# EAGLE design untitled (EAGLE 7.7.0)
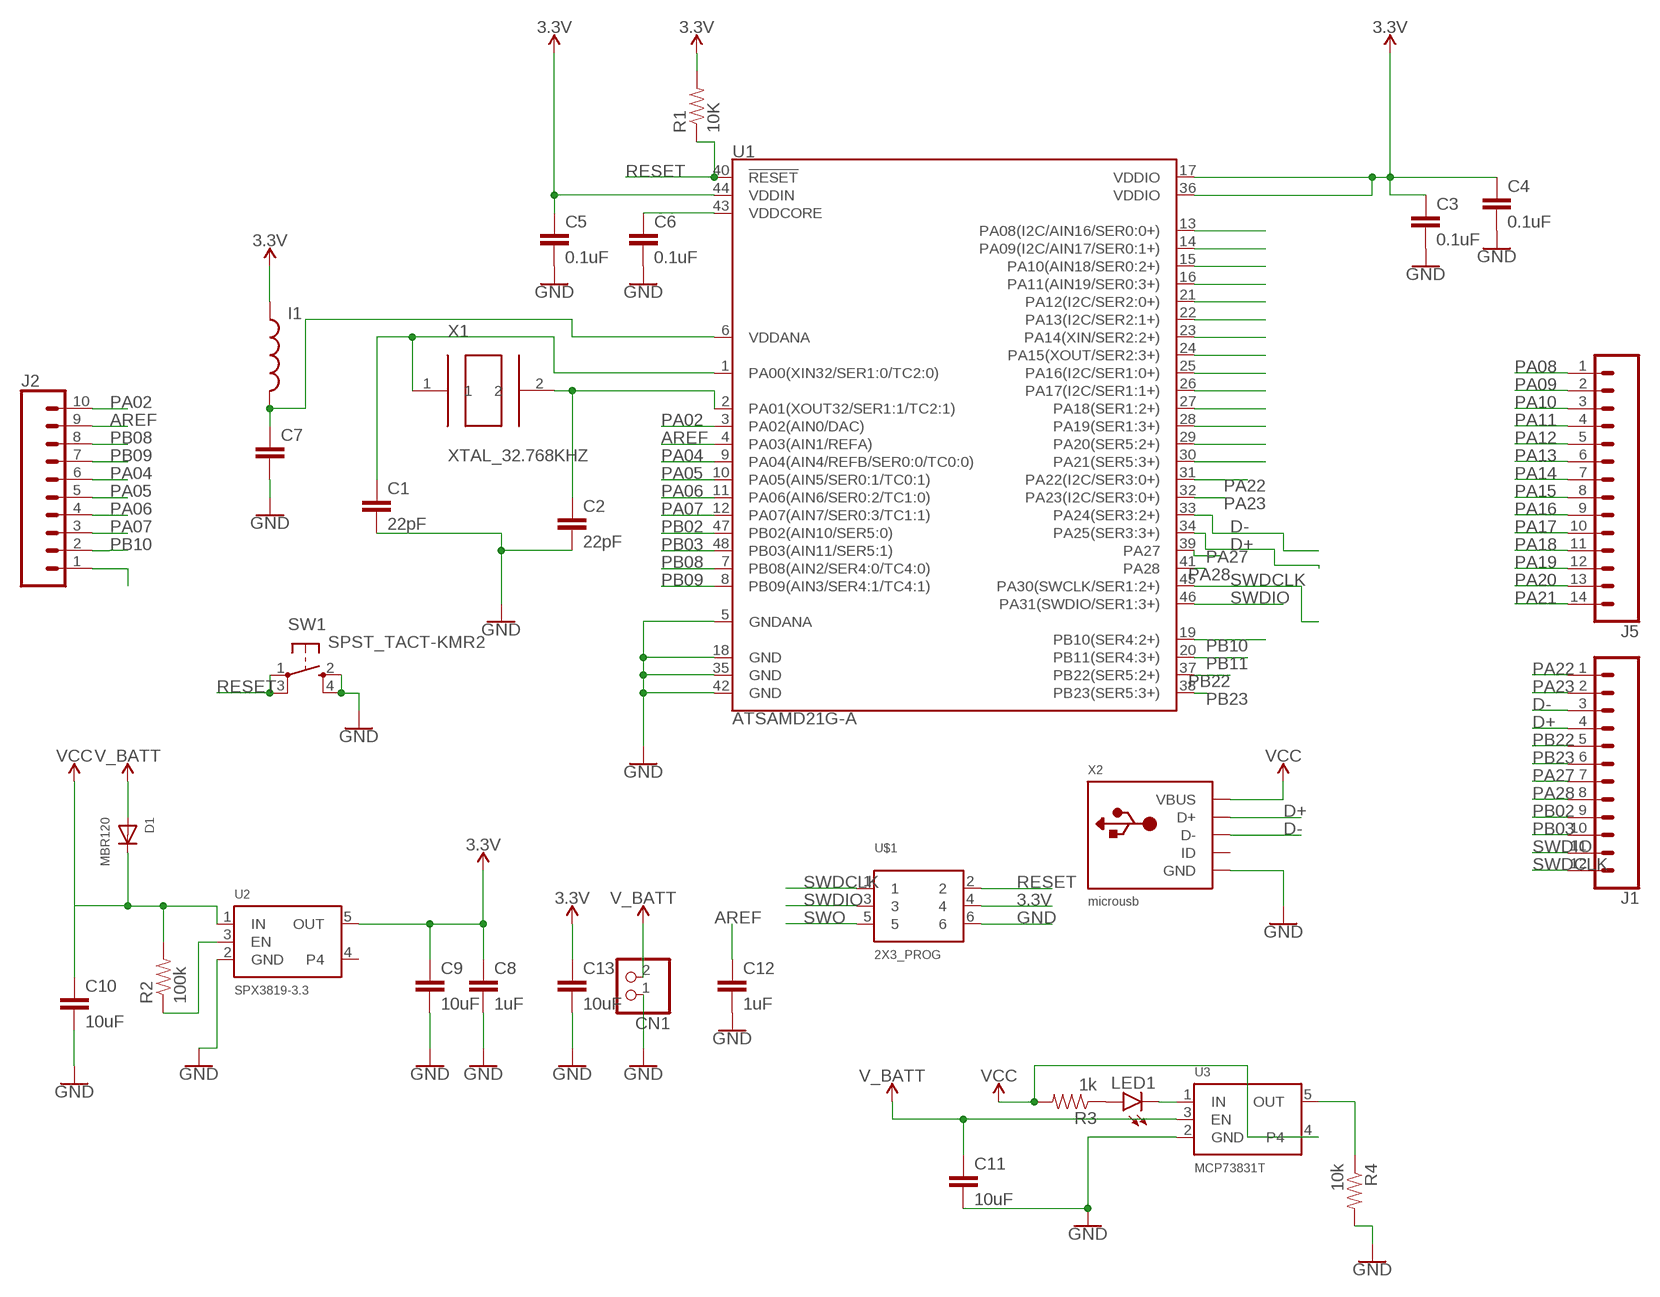
[diagram p0: schematic, sheet 1]

## Parts
C1  22pF  CAP  [0805]
C2  22pF  CAP  [0805]
C3  0.1uF  CAP  [0805]
C4  0.1uF  CAP  [0805]
C5  0.1uF  CAP  [0805]
C6  0.1uF  CAP  [0805]
C7  CAP  [0805]
C8  1uF  CAP  [0805]
C9  10uF  CAP  [0805]
C10  10uF  CAP  [0805]
C11  10uF  CAP  [0805]
C12  1uF  CAP  [0805]
C13  10uF  CAP  [0805]
CN1  JST_2PIN  [JSTPH2]
D1  MBR120  DIODESOD-123  [SOD-123]
I1  IND  [0805]
J1  CONN_12  [1X12]
J2  CONN_10"  [1X10]
J5  CONN_14  [1X14]
LED1  LED0603  [LED-0603]
R1  10K  RES  [0805]
R2  100k  RES  [0805]
R3  1k  RES  [0805]
R4  10k  RES  [0805]
SW1  SPST_TACT-KMR2  [KMR2]
U1  ATSAMD21G-A  [TQFP-48]
U2  SPX3819-3.3  VREG_SOT23-5  [SOT23-5]
U3  MCP73831T  VREG_SOT23-5  [SOT23-5]
U$1  2X3_PROG  [2X3-SMD_PROG]
X1  XTAL_32.768KHZ  [ABS07-32.768KHZ-9-T]
X2  microusb  USB_MICRO_20329_V2  [4UCONN_20329_V2]

## Nets
3.3V: C3.1 C4.1 C5.1 C8.1 C9.1 C13.1 I1.1 R1.2 U1.17(VDDIO) U1.36(VDDIO) U1.44(VDDIN) U2.5(OUT) U$1.4
AREF: C12.1 J2.9 U1.4(PA03(AIN1/REFA))
D+: J1.4 U1.34(PA25(SER3:3+)) X2.D+
D-: J1.3 U1.33(PA24(SER3:2+)) X2.D-
GND: C1.2 C2.2 C3.2 C4.2 C5.2 C6.2 C7.2 C8.2 C9.2 C10.2 C11.2 C12.2 C13.2 CN1.1 R4.2 SW1.2(S) SW1.4(S1) U1.5(GNDANA) U1.18(GND) U1.35(GND) U1.42(GND) U2.2(GND) U3.2(GND) U$1.6 X2.BASE@1(GND) X2.BASE@2(GND) X2.GND X2.SPRT@1(GND) X2.SPRT@2(GND) X2.SPRT@3(GND) X2.SPRT@4(GND)
N$2: C1.1 U1.1(PA00(XIN32/SER1:0/TC2:0)) X1.1
N$3: C2.1 U1.2(PA01(XOUT32/SER1:1/TC2:1)) X1.2
N$4: C6.1 U1.43(VDDCORE)
N$6: C7.1 I1.2 U1.6(VDDANA)
N$21: R2.1 U2.3(EN)
N$22: LED1.A R3.1
N$39: LED1.C U3.1(IN)
N$41: R4.1 U3.5(OUT)
PA02: J2.10 U1.3(PA02(AIN0/DAC))
PA04: J2.6 U1.9(PA04(AIN4/REFB/SER0:0/TC0:0))
PA05: J2.5 U1.10(PA05(AIN5/SER0:1/TC0:1))
PA06: J2.4 U1.11(PA06(AIN6/SER0:2/TC1:0))
PA07: J2.3 U1.12(PA07(AIN7/SER0:3/TC1:1))
PA08: J5.1 U1.13(PA08(I2C/AIN16/SER0:0+))
PA09: J5.2 U1.14(PA09(I2C/AIN17/SER0:1+))
PA10: J5.3 U1.15(PA10(AIN18/SER0:2+))
PA11: J5.4 U1.16(PA11(AIN19/SER0:3+))
PA12: J5.5 U1.21(PA12(I2C/SER2:0+))
PA13: J5.6 U1.22(PA13(I2C/SER2:1+))
PA14: J5.7 U1.23(PA14(XIN/SER2:2+))
PA15: J5.8 U1.24(PA15(XOUT/SER2:3+))
PA16: J5.9 U1.25(PA16(I2C/SER1:0+))
PA17: J5.10 U1.26(PA17(I2C/SER1:1+))
PA18: J5.11 U1.27(PA18(SER1:2+))
PA19: J5.12 U1.28(PA19(SER1:3+))
PA20: J5.13 U1.29(PA20(SER5:2+))
PA21: J5.14 U1.30(PA21(SER5:3+))
PA22: J1.1 U1.31(PA22(I2C/SER3:0+))
PA23: J1.2 U1.32(PA23(I2C/SER3:0+))
PA27: J1.7 U1.39(PA27)
PA28: J1.8 U1.41(PA28)
PB02: J1.9 U1.47(PB02(AIN10/SER5:0))
PB03: J1.10 U1.48(PB03(AIN11/SER5:1))
PB08: J2.8 U1.7(PB08(AIN2/SER4:0/TC4:0))
PB09: J2.7 U1.8(PB09(AIN3/SER4:1/TC4:1))
PB10: J2.2 U1.19(PB10(SER4:2+))
PB11: J2.1 U1.20(PB11(SER4:3+))
PB22: J1.5 U1.37(PB22(SER5:2+))
PB23: J1.6 U1.38(PB23(SER5:3+))
RESET: R1.1 SW1.1(P) SW1.3(P1) U1.40(!RESET!) U$1.2
SWDCLK: J1.12 U1.45(PA30(SWCLK/SER1:2+)) U$1.1
SWDIO: J1.11 U1.46(PA31(SWDIO/SER1:3+)) U$1.3
SWO: U$1.5
V_BATT: C11.1 CN1.2 D1.A U3.3(EN)
VCC: C10.1 D1.C R2.2 R3.2 U2.1(IN) U3.4 X2.VBUS
Unconnected: U2.4 X2.ID

## Library data of the parts
C1-C13 = Ilya_Teach:CAP
CN1 = microbuilder:JST_2PIN: JST 2-Pin Right-Angle Connector PH-Series - 4UConnector: 17311 SH-Series - 4UConnector: 07278
D1 = microbuilder:DIODE: Diode SMA Model Volts Amps Type Vf Vr Digikey # Notes SSA34-E3 40V 3A Schottky 480mV @ 3A 200uA @ 40V SSA34-E3/61TGITR-ND CDBA120-G 20V 1A Schottky 500mV @ 1A 500uA @ 20V 641-1014-6-ND REEL MBRA210 10V 2A Schottky 350mV @ 2A 700uA @ 10V MBRA210LT3 SOD-123 Model Volts Amps Type Vf Vr Order # Notes BAT54T1G 30V 200mA Schottky 800mV @ 200mA 2uA @ 25V BAT54T1GOSTR-ND B0530W 30V 500mA Schottky 430mV @ 500mA 130uA @ 30V B0530W-FDICT-ND REEL MBR120 1A 20V Schottky 340mV @ 1A MBR120VLSFT1GOSCT-ND SOD-323 Model Volts Amps Type Vf Vr Order # Notes PMEG2005EJ 20V 500mA Schottky 355mV @ 500mA 568-4110-1-ND ZLLS410 10V 570mA Schottky 380mV @ 570mA ZLLS410CT-ND 1N4148WS 75V 150mA Silicon/Simple 1V 1N4148WSFSCT-ND REEL SOD-523 Model Volts Amps Type Vf Vr Order # Notes BAT54XV2 30V 200mA Schottky 0.8V @ 100mA BAT54XV2CT-ND TB751S 30V 30mA Schottky RB751S-40TE61CT-ND SOT23-R/W (R = Solder Paste/Reflow Ovens, W = Hand-Soldering) Model Volts Amps Type Vf Vr Order # Notes BAT54FILM 40V 300mA Schottky 497-7162-1-ND
I1 = Ilya_Teach:IND
J1 = SparkFun-Connectors:CONN_12: Multi connection point. Often used as Generic Header-pin footprint for 0.1 inch spaced/style header connections On any of the 0.1 inch spaced packages, you can populate with these: Break Away Headers - Straight <https://www.sparkfun.com/products/116> (PRT-00116) Break Away Male Headers - Right Angle <https://www.sparkfun.com/products/553> (PRT-00553) Female Headers <https://www.sparkfun.com/products/115> (PRT-00115) Break Away Headers - Machine Pin <https://www.sparkfun.com/products/117> (PRT-00117) Break Away Female Headers - Swiss Machine Pin <https://www.sparkfun.com/products/743> (PRT-00743) For SCREWTERMINALS and SPRING TERMINALS visit here: Screw Terimnals on SparkFun.com <https://www.sparkfun.com/search/results?term=Screw+Terminals> (5mm/3.5mm/2.54mm spacing) This device is also useful as a general connection point to wire up your design to another part of your project. Our various solder wires solder well into these plated through hole pads. Hook-Up Wire - Assortment (Stranded, 22 AWG) <https://www.sparkfun.com/products/11375> (PRT-11375) Hook-Up Wire - Assortment (Solid Core, 22 AWG) <https://www.sparkfun.com/products/11367> (PRT-11367) View the entire wire category on our website here <https://www.sparkfun.com/categories/141> Special notes: Molex polarized connector foot print use with SKU : PRT-08231 with associated crimp pins and housings. 1MM SMD Version SKU: PRT-10208 NOTES ON THE VARIANTS LOCK and LOCK_LONGPADS... This footprint was designed to help hold the alignment of a through-hole component (i.e. 6-pin header) while soldering it into place. You may notice that each hole has been shifted either up or down by 0.005 of an inch from it's more standard position (which is a perfectly straight line). This slight alteration caused the pins (the squares in the middle) to touch the edges of the holes. Because they are alternating, it causes a "brace" to hold the component in place. 0.005 has proven to be the perfect amount of "off-center" position when using our standard breakaway headers. Although looks a little odd when you look at the bare footprint, once you have a header in there, the alteration is very hard to notice. Also,if you push a header all the way into place, it is covered up entirely on the bottom side.
J2 = SparkFun-Connectors:CONN_10: Multi connection point. Often used as Generic Header-pin footprint for 0.1 inch spaced/style header connections On any of the 0.1 inch spaced packages, you can populate with these: Break Away Headers - Straight <https://www.sparkfun.com/products/116> (PRT-00116) Break Away Male Headers - Right Angle <https://www.sparkfun.com/products/553> (PRT-00553) Female Headers <https://www.sparkfun.com/products/115> (PRT-00115) Break Away Headers - Machine Pin <https://www.sparkfun.com/products/117> (PRT-00117) Break Away Female Headers - Swiss Machine Pin <https://www.sparkfun.com/products/743> (PRT-00743) Arduino Stackable Header - 10 Pin <https://www.sparkfun.com/products/11376> (PRT-11376) For SCREWTERMINALS and SPRING TERMINALS visit here: Screw Terimnals on SparkFun.com <https://www.sparkfun.com/search/results?term=Screw+Terminals> (5mm/3.5mm/2.54mm spacing) This device is also useful as a general connection point to wire up your design to another part of your project. Our various solder wires solder well into these plated through hole pads. Hook-Up Wire - Assortment (Stranded, 22 AWG) <https://www.sparkfun.com/products/11375> (PRT-11375) Hook-Up Wire - Assortment (Solid Core, 22 AWG) <https://www.sparkfun.com/products/11367> (PRT-11367) View the entire wire category on our website here <https://www.sparkfun.com/categories/141> Special notes: Molex polarized connector foot print use with SKU : PRT-08231 with associated crimp pins and housings. 1MM SMD Version SKU: PRT-10208 NOTES ON THE VARIANTS LOCK and LOCK_LONGPADS... This footprint was designed to help hold the alignment of a through-hole component (i.e. 6-pin header) while soldering it into place. You may notice that each hole has been shifted either up or down by 0.005 of an inch from it's more standard position (which is a perfectly straight line). This slight alteration caused the pins (the squares in the middle) to touch the edges of the holes. Because they are alternating, it causes a "brace" to hold the component in place. 0.005 has proven to be the perfect amount of "off-center" position when using our standard breakaway headers. Although looks a little odd when you look at the bare footprint, once you have a header in there, the alteration is very hard to notice. Also,if you push a header all the way into place, it is covered up entirely on the bottom side.; PROD_ID: CONN-11563
J5 = SparkFun-Connectors:CONN_14: Multi connection point. Often used as Generic Header-pin footprint for 0.1 inch spaced/style header connections On any of the 0.1 inch spaced packages, you can populate with these: Break Away Headers - Straight <https://www.sparkfun.com/products/116> (PRT-00116) Break Away Male Headers - Right Angle <https://www.sparkfun.com/products/553> (PRT-00553) Female Headers <https://www.sparkfun.com/products/115> (PRT-00115) Break Away Headers - Machine Pin <https://www.sparkfun.com/products/117> (PRT-00117) Break Away Female Headers - Swiss Machine Pin <https://www.sparkfun.com/products/743> (PRT-00743) For SCREWTERMINALS and SPRING TERMINALS visit here: Screw Terimnals on SparkFun.com <https://www.sparkfun.com/search/results?term=Screw+Terminals> (5mm/3.5mm/2.54mm spacing) This device is also useful as a general connection point to wire up your design to another part of your project. Our various solder wires solder well into these plated through hole pads. Hook-Up Wire - Assortment (Stranded, 22 AWG) <https://www.sparkfun.com/products/11375> (PRT-11375) Hook-Up Wire - Assortment (Solid Core, 22 AWG) <https://www.sparkfun.com/products/11367> (PRT-11367) View the entire wire category on our website here <https://www.sparkfun.com/categories/141> Special notes: Molex polarized connector foot print use with SKU : PRT-08231 with associated crimp pins and housings. 1MM SMD Version SKU: PRT-10208 NOTES ON THE VARIANTS LOCK and LOCK_LONGPADS... This footprint was designed to help hold the alignment of a through-hole component (i.e. 6-pin header) while soldering it into place. You may notice that each hole has been shifted either up or down by 0.005 of an inch from it's more standard position (which is a perfectly straight line). This slight alteration caused the pins (the squares in the middle) to touch the edges of the holes. Because they are alternating, it causes a "brace" to hold the component in place. 0.005 has proven to be the perfect amount of "off-center" position when using our standard breakaway headers. Although looks a little odd when you look at the bare footprint, once you have a header in there, the alteration is very hard to notice. Also,if you push a header all the way into place, it is covered up entirely on the bottom side.
LED1 = Ilya_Teach:LED: LEDs Standard schematic elements and footprints for 5mm, 3mm, 1206, and 0603 sized LEDs. 5mm - Spark Fun Electronics SKU : COM-00529 (and others)
R1-R4 = Ilya_Teach:RES
SW1 = adafruit:SPST_TACT: SMT 6mm switch, EVQQ2 series http://www.ladyada.net/library/eagle
U1 = SparkFun-IC-Microcontroller:ATSAMD21G: Atmel SAMD21G SMART ARM-Based Microcontroller The Atmel ® | SMART ™ SAM D21 is a series of low-power microcontrollers using the 32-bit ARM ® Cortex ® -M0+ processor, and ranging from 32- to 64-pins with up to 256KB Flash and 32KB of SRAM. The SAM D21 devices operate at a maximum frequency of 48MHz and reach 2.46 CoreMark/MHz. They are designed for simple and intuitive migration with identical peripheral modules, hex compatible code, identical linear address map and pin compatible migration paths between all devices in the product series. All devices include intelligent and flexible peripherals, Atmel Event System for inter-peripheral signaling, and support for capacitive touch button, slider and wheel user interfaces. Datasheet <https://cdn.sparkfun.com/datasheets/Dev/Arduino/Boards/Atmel-42181-SAM-D21_Datasheet.pdf> SparkFun Products SparkFun SAMD21 Mini Breakout <https://www.sparkfun.com/products/13664> (DEV-13664) SparkFun SAMD21 Dev Breakout <https://www.sparkfun.com/products/13672> (DEV-13672); PROD_ID: IC-13064
U2 U3 = microbuilder:VREG_SOT23-5: SOT23-5 Fixed Voltage Regulators To better organise some of the SOT23-5 fixed voltage regulators in this library, this new part was created. Part Current Out V Out V In V Dropout Digikey Part No. ADP121 150mA 3.3V 3.4-5.5V 0.09V @ 150mA ADP121-AUJZ33R7CT-ND ADP121 150mA 3.0V 3.1-5.5V 0.09V @ 150mA ADP121-AUJZ30R7CT-ND ADP122 300mA 3.3V 3.4-5.5V 0.085V @ 300mA ADP122AUJZ-3.3-R7CT-ND ADP1712 300mA 3.3V 3.5-5.5V 0.17V @ 300mA ADP1712AUJZ-3.3-R7TR-ND AP7311 (Low Cost) 150mA 3.3V 3.5-6V 0.15V @ 150mA AP7311-33WG-7DICT-ND LD39015M18R 150mA 1.8V 1.9V-5.5V 0.08V @ 100mA 497-6977-1-ND MCP1824T-3302E/OT 300mA 3.3V 3.5V-6V 0.2V @ 300mA MCP1824T-3302E/OTCT-ND MIC5205-2.5YM5 TR 150mA 2.5V 2.7-16V 0.165V @ 150mA 576-1257-2-ND MIC5205-3.0YM5 TR 150mA 3.0V 3.2V-16V 0.165V @ 150mA 576-1258-2-ND MIC5205-3.3YM5 TR 150mA 3.3V 3.5V-16V 0.165V @ 150mA 576-1259-2-ND TPS780330220 150mA 3.3V+2.2V 3.6-5.5V 250mV Max 296-23332-1-ND TDA3663/N1,135 100mA 3.3V 3.5-45V 0.18V @ 50mA 568-5343-1-ND
U$1 = Ilya_Teach:2X3_PROG
X1 = Ilya_Teach:XTAL_32.768KHZ
X2 = microbuilder:USB: USB Connectors USBMINIB - Surface Mount Female Mini-B USB Connector 4UConnector: 06564

## Board
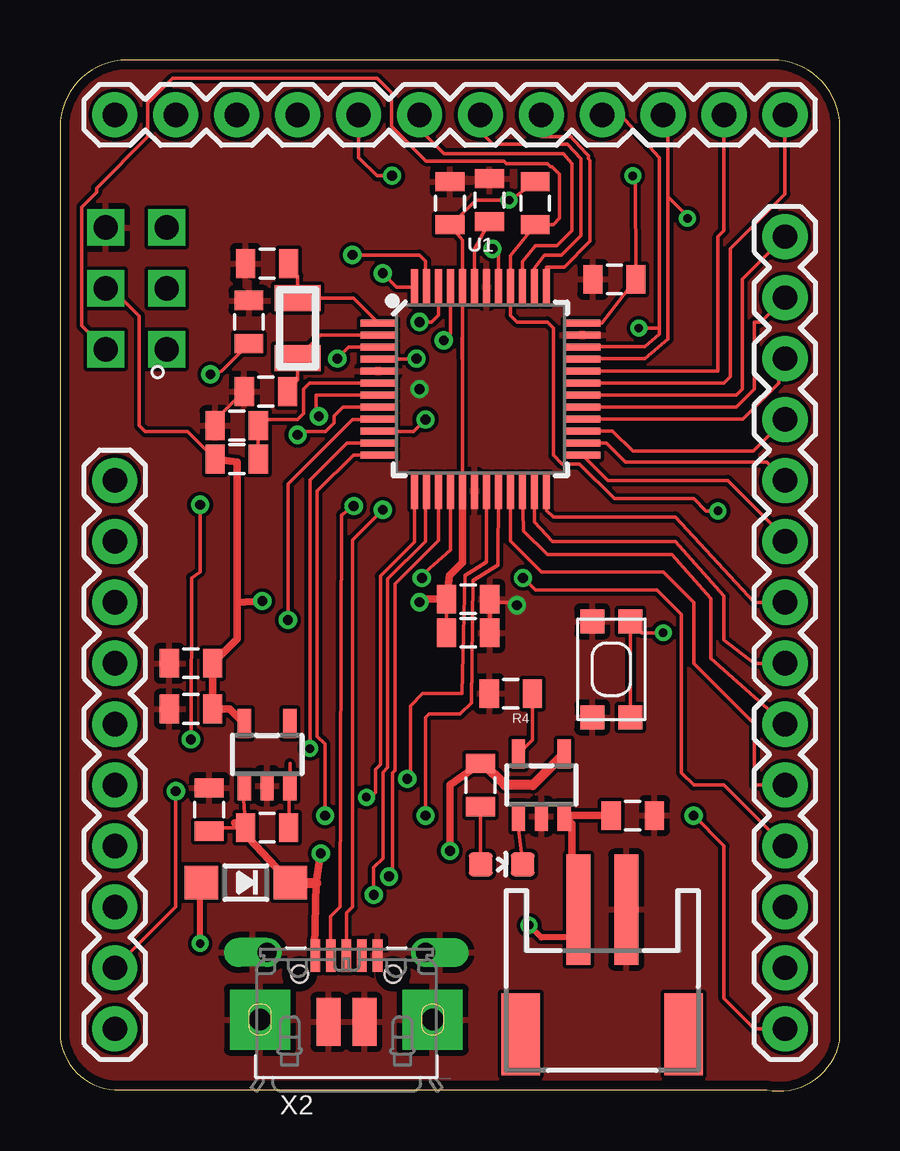
[diagram p1: board, top side]
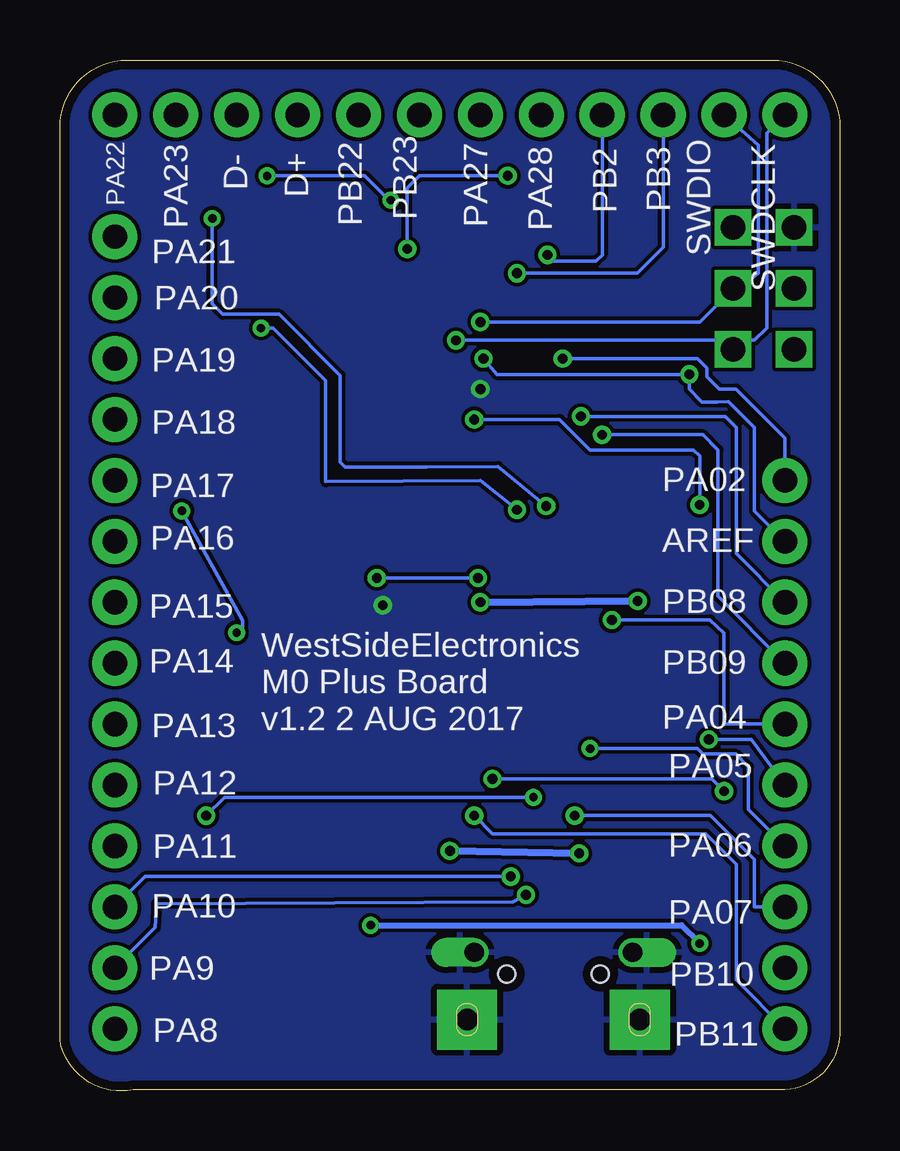
[diagram p2: board, bottom side, seen from below]

Size 32.51 x 42.98 mm. Coordinates in mm from the lower left corner, seen from the top.
Outline: 29.72,42.98 2.8,42.98 arc90 0,40.18 0,2.59 arc90 2.29,0.05 29.47,0.05 arc90 32.51,2.08 32.51,40.18 arc90 29.72,42.98
Copper layers (1*16): Top 0.0356mm / dielectric 1.5011mm / Bottom 0.0356mm
Design rules "LaenPCBOrder": minimum track width 6mil, minimum drill 13mil, track to track 6mil, track to pad 6mil, pad to pad 6mil, via to via 6mil, smd to smd 6mil, copper to edge 15mil, drill to drill 6mil, minimum pad ring 7mil, minimum via ring 7mil, stop-mask expansion 3mil, vias tented up to drill 0mil, thermal gap 10mil

### Footprints (pad centres in the part's own frame; a part is rotated, then mirrored left to right if it is on the bottom)
0805 = smd 0.8 x 1.2: 1 -0.9,0; 2 0.9,0
JSTPH2 = smd 1 x 4.6: 1 -1,-3.7; 2 1,-3.7 | smd 1.6 x 3.4: NC1 -3.4,1.5; NC2 3.4,1.5
SOD-123 = smd 1.4 x 1.4: A 1.85,0; C -1.85,0
1X12 = drill 1.016 pad 1.88: 1 0,0; 2 2.54,0; 3 5.08,0; 4 7.62,0; 5 10.16,0; 6 12.7,0; 7 15.24,0; 8 17.78,0; 9 20.32,0; 10 22.86,0; 11 25.4,0; 12 27.94,0
1X10 = drill 1.016 pad 1.88: 1 0,0; 2 2.54,0; 3 5.08,0; 4 7.62,0; 5 10.16,0; 6 12.7,0; 7 15.24,0; 8 17.78,0; 9 20.32,0; 10 22.86,0
1X14 = drill 1.016 pad 1.88: 1 0,0; 2 2.54,0; 3 5.08,0; 4 7.62,0; 5 10.16,0; 6 12.7,0; 7 15.24,0; 8 17.78,0; 9 20.32,0; 10 22.86,0; 11 25.4,0; 12 27.94,0; 13 30.48,0; 14 33.02,0
LED-0603 = smd 1 x 1: A 0,-0.877; C 0,0.877
KMR2 = smd 1 x 1: 1 2,0.8; 2 2,-0.8; 3 -2,0.8; 4 -2,-0.8
TQFP-48 = smd 1.5 x 0.28: 1 -4.25,2.75; 2 -4.25,2.25; 3 -4.25,1.75; 4 -4.25,1.25; 5 -4.25,0.75; 6 -4.25,0.25; 7 -4.25,-0.25; 8 -4.25,-0.75; 9 -4.25,-1.25; 10 -4.25,-1.75; 11 -4.25,-2.25; 12 -4.25,-2.75; 25 4.25,-2.75; 26 4.25,-2.25; 27 4.25,-1.75; 28 4.25,-1.25; 29 4.25,-0.75; 30 4.25,-0.25; 31 4.25,0.25; 32 4.25,0.75; 33 4.25,1.25; 34 4.25,1.75; 35 4.25,2.25; 36 4.25,2.75 | smd 0.28 x 1.5: 13 -2.75,-4.25; 14 -2.25,-4.25; 15 -1.75,-4.25; 16 -1.25,-4.25; 17 -0.75,-4.25; 18 -0.25,-4.25; 19 0.25,-4.25; 20 0.75,-4.25; 21 1.25,-4.25; 22 1.75,-4.25; 23 2.25,-4.25; 24 2.75,-4.25; 37 2.75,4.25; 38 2.25,4.25; 39 1.75,4.25; 40 1.25,4.25; 41 0.75,4.25; 42 0.25,4.25; 43 -0.25,4.25; 44 -0.75,4.25; 45 -1.25,4.25; 46 -1.75,4.25; 47 -2.25,4.25; 48 -2.75,4.25
SOT23-5 = smd 0.55 x 1.2: 1 -0.95,-1.3; 2 0,-1.3; 3 0.95,-1.3; 4 0.95,1.3; 5 -0.95,1.3
2X3-SMD_PROG = drill 1.016 pad 1.27 square: 1 -1.27,-1.27; 2 -1.27,1.27; 3 1.27,-1.27; 4 1.27,1.27; 5 3.81,-1.27; 6 3.81,1.27
ABS07-32.768KHZ-9-T = smd 1.1 x 1.9: 1 -1.25,0; 2 1.25,0
4UCONN_20329_V2 = smd 1 x 2: BASE@1 -0.75,-2; BASE@2 0.75,-2 | smd 0.4 x 1.35: D+ 0,0.775; D- -0.65,0.775; GND 1.3,0.775; ID 0.65,0.775; VBUS -1.3,0.775 | drill 0.8 pad 1.2 offset: SPRT@1 -3.3,0.9; SPRT@2 3.3,0.9 | drill 0.9 pad 2.5 square: SPRT@3 -3.6,-1.9; SPRT@4 3.6,-1.9 | hole 0.7: -1.95,0; 1.95,0

### Placement (x,y rotation side)
C1  8.64,34.49 180 top
C2  8.59,29.16 180 top
C3  17.02,20.5 0 top
C4  23.12,33.83 180 top
C5  16.26,37.01 90 top
C6  17.91,37.13 90 top
C7  7.37,27.74 180 top
C8  5.46,17.83 180 top
C9  5.46,15.93 180 top
C10  6.22,11.73 90 top
C11  23.88,11.48 0 top
C12  7.88,32.05 90 top
C13  17.02,19.1 0 top
CN1  22.61,3.86 180 top
D1  7.75,8.69 180 top
I1  7.37,26.34 0 top
J1  30.23,40.69 180 top
J2  2.29,2.59 90 top
J5  30.23,2.59 90 top
LED1  18.42,9.45 270 top
R1  19.81,37.01 90 top
R2  8.64,10.97 180 top
R3  17.53,12.75 90 top
R4  18.8,16.56 180 top
SW1  22.99,17.58 270 top
U1  17.53,29.26 0 top
U2  8.64,14.02 0 top
U3  20.07,12.75 0 top
U$1  3.18,32.18 90 top
X1  9.91,31.8 270 top
X2  11.94,4.88 0 top

### Tracks (layer width: path | path; a pad name or v marks a point on that pad's centre or on a via)
3.3V  (via drill 0.35, 0.41)
  Top 0.152: 16.28,36.08 16.78,35.46 U1.44 16.78,32.32 | 16.28,36.08 C5.1 | U1.36 22.6,32.01 C4.1 23.99,38.03 v23.88,38.15 | U1.17 16.78,32.32 | 16.77,30.53 16.78,32.32 | C13.1 C3.1 | U$1.4 2.16,33.45 3.3,32.31 3.3,27.74 3.56,27.48 5.32,27.48 I1.1 | R1.2 18.79,37.13 v18.72,37.13 17.33,37.13 16.28,36.08
  Top 0.305: I1.1 7.38,26.21 7.38,20.37 | 7.38,20.37 7.38,18.85 C8.1 C9.1 7.08,15.93 U2.5 | 7.38,20.37 v8.43,20.42 | 16.26,20.37 C3.1 | U1.17 16.78,22.02 16.25,21.49 C3.1 | v14.99,20.37 15.11,20.5 C3.1
  Bottom 0.152: v8.43,20.42 8.89,20.37 | v23.88,38.15 19.81,38.15 18.8,37.13 v18.72,37.13
  Bottom 0.305: v8.43,20.42 v14.99,20.37
AREF  (via drill 0.41)
  Top 0.152: U1.4 14.97,30.51 v14.86,30.53 | C12.1 6.73,30.01 v6.28,29.87
  Bottom 0.152: v14.86,30.53 14.3,29.87 v6.28,29.87 6.28,29.26 5.75,28.73 5.11,28.73 4.66,28.73 3.56,27.65 3.56,24.18 J2.9
D+  (via drill 0.35, 0.41)
  Top 0.152: v13.46,24.23 12.19,22.96 12.19,7.67 11.94,7.42 X2.D+ | U1.34 21.81,31.04 24.39,31.04 25,31.55 25,31.82 | 25,31.82 25,38.91 23.37,40.69 J1.4 | v24.13,31.8 24.98,31.8 25,31.82
  Bottom 0.152: v13.46,24.23 14.99,25.45 21.44,25.4 21.44,29.62 23.62,31.8 v24.13,31.8
D-  (via drill 0.35, 0.41)
  Top 0.152: v12.24,24.38 11.8,24.05 11.74,24 11.69,7.67 11.29,7.27 X2.D- | U1.33 21.8,30.53 24.39,30.53 25.35,31.34 25.35,37.27 | J1.3 25.35,40.39 25.35,37.27 | v26.16,36.37 26.16,36.46 25.35,37.27
  Bottom 0.152: v12.24,24.38 14.25,26.03 17.22,26.01 18.8,26.01 | 18.8,26.01 18.98,26.01 | 18.8,26.01 20.63,26.01 20.83,26.21 20.83,29.83 23.38,32.38 25.73,32.38 26.16,32.82 v26.16,36.37
GND  (via drill 0.41)
  Top 0.152: C2.2 6.47,27.99 C7.2 | C13.2 C3.2 17.92,20.37 18.8,20.37
  other vias: 19.05,20.24 14.99,29.26
  pour Top: -0.25,48.31 48.01,48.31 48.01,0.05 -0.25,0.05 -0.25,47.04
  pour Bottom: -0.25,48.31 48.01,48.31 48.01,0.05 -0.25,0.05
N$2
  Top 0.152: C1.1 9.91,33.97 X1.1 12.24,33.05 U1.1
N$3
  Top 0.152: C2.1 9.91,29.63 X1.2 10.87,31.51 U1.2
N$4
  Top 0.152: U1.43 17.28,35.1 C6.1
N$6
  Top 0.152: I1.2 C7.1 8.26,27.98 9.91,27.99 10.16,28.24 10.16,29.26 10.41,29.51 U1.6
N$21
  Top 0.152: R2.1 9.59,13.65 U2.3
N$22
  Top 0.152: LED1.A R3.1
N$39
  Top 0.152: LED1.C 19.12,10.92 U3.1
N$41
  Top 0.152: U3.5 19.7,14.63 R4.1
PA02  (via drill 0.41)
  Top 0.152: U1.3 12.04,31.01 v11.56,30.53
  Bottom 0.152: v11.56,30.53 5.94,30.53 5.54,30.13 5.54,29.78 5.02,29.26 4.34,29.26 2.29,27.21 J2.10
PA04  (via drill 0.41)
  Top 0.152: U1.9 13.26,27.99 12.19,27.99 11.05,26.85 10.92,26.72 9.5,25.3 v9.5,19.63
  Bottom 0.152: v9.5,19.63 5.41,19.63 4.83,19.1 4.83,15.29 J2.6
PA05  (via drill 0.41)
  Top 0.152: v5.84,24.43 5.84,21.64 5.49,21.39 v5.46,14.66 | v15.24,27.99 14.73,27.48 13.72,27.48 13.69,27.51 U1.10
  Bottom 0.152: v5.46,14.66 3.68,14.66 J2.5 | v15.24,27.99 11.69,27.99 10.42,26.72 6.1,26.72 5.84,26.47 v5.84,24.43
PA06  (via drill 0.35)
  Top 0.152: U1.11 11.98,27.01 10.42,25.46 10.42,14.28 v10.42,14.27
  Bottom 0.152: J2.4 3.81,11.73 3.81,13.51 4.34,14.05 5.72,14.05 5.94,14.27 v10.42,14.27
PA07  (via drill 0.41)
  Top 0.152: 13.72,26.51 U1.12 12.24,26.51 10.73,25 10.73,14.78 11.05,14.46 v11.05,11.48
  Bottom 0.152: v11.05,11.48 5.39,11.48 3.56,9.65 3.56,7.67 J2.3
PA08  (via drill 0.35, 0.41)
  Top 0.152: J5.1 28.96,2.59 27.69,3.86 27.69,10.21 v26.42,11.48 | U1.13 14.78,22.88 13.36,21.46 13.36,13.61 13.16,13.41 13.16,12.45 12.96,12.24 v12.77,12.24
  Bottom 0.152: v12.77,12.24 25.66,12.24 v26.42,11.48
PA09  (via drill 0.41)
  Top 0.152: v13.08,8.18 13.08,9.32 13.46,9.7 13.46,13.28 13.67,13.48 13.67,21.34 15.24,22.91 15.24,24.97 U1.14
  Bottom 0.152: v13.08,8.18 13.63,7.88 28.49,7.81 28.54,6.82 J5.2
PA10  (via drill 0.41)
  Top 0.152: U1.15 15.78,22.94 13.97,21.13 13.97,13.36 13.87,13.26 13.87,9.09 v13.72,8.94
  Bottom 0.152: v13.72,8.94 28.96,8.94 J5.3
PA11  (via drill 0.41)
  Top 0.152: 16.26,24.99 arc-90 U1.16 16.28,22.55 15.24,21.64 v15.09,21.39 | J5.4 27.69,12.75 26.42,12.75 25.91,13.26 25.91,19.86 24.89,20.88 19.81,20.88 v19.31,21.39
  Bottom 0.152: v15.09,21.39 v19.31,21.39
PA12
  Top 0.152: U1.21 18.78,22.93 20.07,21.64 25.15,21.64 26.42,20.37 26.42,17.83 28.96,15.29 28.96,12.75 J5.5
PA13
  Top 0.152: J5.6 27.13,18.03 27.13,20.52 25.5,22.35 20.32,22.35 19.33,23.34 U1.22
PA14
  Top 0.152: J5.7 28.96,17.83 27.69,18.8 27.69,20.62 25.66,22.91 20.52,22.91 19.78,23.71 U1.23
PA15
  Top 0.152: U1.24 20.29,24.2 20.57,23.93 25.66,23.93 28.96,20.37 J5.8
PA16
  Top 0.152: U1.25 22.84,25.45 27.84,25.45 30.23,23.06 J5.9
PA17
  Top 0.152: U1.26 22.77,27.01 23.57,26.21 29.47,26.21 J5.10
PA18
  Top 0.152: U1.27 23.04,27.51 23.88,26.67 28.91,26.67 J5.11
PA19
  Top 0.152: U1.28 28.47,28.01 29.97,29.51 29.97,30.28 J5.12
PA20
  Top 0.152: U1.29 28.21,28.51 28.96,29.26 28.96,32.05 29.21,32.05 J5.13
PA21
  Top 0.152: U1.30 28.2,29.01 28.45,29.26 28.45,33.83 J5.14
PA22
  Top 0.152: U1.31 27.68,29.51 27.94,29.77 27.94,35.1 30.23,37.39 J1.1
PA23
  Top 0.152: U1.32 27.42,30.01 27.43,30.02 27.43,35.61 27.69,35.86 J1.2
PA27
  Top 0.152: U1.39 19.28,34.57 19.81,35.23 20.71,35.23 21.35,35.86 21.34,38.66 20.98,39.06 16,39.06 14.99,40.08 J1.7
PA28  (via drill 0.41)
  Top 0.152: U1.41 18.28,34.85 v18.04,35.1 | v13.84,38.15 13.21,38.15 12.45,38.91 J1.8
  Bottom 0.152: v18.04,35.1 18.04,37.64 17.53,38.15 v13.84,38.15
PB02  (via drill 0.41)
  Top 0.152: v12.19,34.85 14.99,34.85 15.24,34.59 15.24,33.55 U1.47
  Bottom 0.152: J1.9 9.91,34.85 10.16,34.59 11.94,34.59 v12.19,34.85
PB03  (via drill 0.41)
  Top 0.152: U1.48 14.04,33.51 v13.46,34.09
  Bottom 0.152: v13.46,34.09 8.45,34.09 7.37,35.16 J1.10
PB08  (via drill 0.41)
  Top 0.152: v10.8,28.12 10.67,28.24 10.67,29.01 U1.7
  Bottom 0.152: v10.8,28.12 4.78,28.12 4.32,27.66 4.32,22.4 J2.8
PB09  (via drill 0.41)
  Top 0.152: v9.91,27.36 10.03,27.48 11.07,27.48 11.43,27.84 11.43,28.14 11.8,28.51 U1.8
  Bottom 0.152: v9.91,27.36 5.72,27.36 5.08,26.72 5.08,20.62 J2.7
PB10  (via drill 0.41)
  Top 0.152: U1.19 17.78,22.04 16.89,21.49 16.77,16.56 15.11,16.56 14.61,16.05 14.61,13.39 v14.48,13 | v4.83,12.5 4.83,7.67 J2.2
  Bottom 0.152: v14.48,13 5.34,13 v4.83,12.5
PB11  (via drill 0.41)
  Top 0.152: U1.20 18.25,21.93 17.22,21.28 17.15,16.18 16.68,15.71 15.38,15.71 15.24,15.57 v15.24,11.48
  Bottom 0.152: J2.1 4.32,4.62 4.32,9.45 5.59,10.72 14.48,10.72 v15.24,11.48
PB22
  Top 0.152: U1.37 20.28,34.34 21.02,34.34 22.1,35.42 22.1,38.78 22.02,38.86 22.03,38.97 22.02,38.98 22.02,38.99 21.94,39.07 21.46,39.59 21.46,39.6 21.38,39.68 21.3,39.77 21.29,39.77 21.29,39.78 21.17,39.78 21.05,39.78 21.04,39.78 20.07,39.78 J1.5
PB23
  Top 0.152: U1.38 19.78,34.3 20.19,34.85 20.91,34.85 21.72,35.66 21.72,38.86 21.16,39.47 18.04,39.47 17.53,39.99 J1.6
RESET  (via drill 0.35)
  Top 0.152: v27.43,24.18 26.93,24.18 26.42,24.69 23.12,24.69 21.66,26.14 20.93,26.14 20.58,26.5 20.58,31.8 20.32,32.05 19.05,32.05 18.78,32.33 U1.40 18.78,34.82 R1.1 20.56,36.11 20.83,36.37 20.83,38.21 20.51,38.54 20.44,38.54 20.32,38.66 18.61,38.66 18.51,38.76 15.27,38.76 13.82,40.21 13.82,41.6 13.21,42.21 4.7,42.21 3.66,41.17 3.66,39.78 1.53,37.64 1.53,37.46 0.92,36.85 0.92,31.9 U$1.2 | v25.15,19.1 24.26,19.1 SW1.3 SW1.1
  Bottom 0.152: v27.43,24.18 24.89,19.61 24.89,19.1 v25.15,19.1
SWDCLK  (via drill 0.41)
  Top 0.152: v16,31.29 16.28,31.57 U1.45
  Bottom 0.152: U$1.1 4.83,31.29 | 4.83,31.29 v16,31.29 | 4.83,31.29 3.56,31.29 3.05,31.8 3.05,39.93 J1.12
SWDIO  (via drill 0.41)
  Top 0.152: v14.99,32.05 15.5,32.05 15.78,32.34 U1.46
  Bottom 0.152: v14.99,32.05 5.84,32.05 U$1.3 4.19,33.45 3.41,34.09 3.41,39.42 J1.11
V_BATT  (via drill 0.35)
  Top 0.152: CN1.2 21.45,7.56 21.34,7.67
  Top 0.254: 21.34,6.4 20.07,6.4 v19.56,6.91 | v5.84,6.15 5.84,8.63 D1.A
  Top 0.305: 21.34,7.67 21.34,11.13 U3.3 21.05,11.48 C11.1 | 21.34,6.4 21.34,7.29 CN1.2
  Bottom 0.254: v19.56,6.91 6.61,6.91 v5.84,6.15
VCC  (via drill 0.41)
  Top 0.152: U2.1 7.62,12.72 R2.2 6.35,10.97 C10.1 | X2.VBUS 10.64,5.98 10.62,6
  Top 0.305: v16.26,10.01 16.26,12.75 R3.2 | 10.61,5.87 10.62,6 10.68,8.67 v10.87,9.91 | D1.C 7.28,11.17 R2.2
  Top 0.406: D1.C 9.61,8.67 10.68,8.67 | U3.4 19.72,12.75 18.54,12.75 17.64,13.65 R3.2
  Bottom 0.305: v10.87,9.91 v16.26,10.01

### Text on the board
bPlace: SWDCLK | SWDIO | PA27 | PB23 | PB22 | PA23 | PA22 | PB3 | PB2 | PA28 | D+ | D- | PA21 | PA20 | PA19 | PA18 | PA02 | PA17 | PA16 | AREF | PB08 | PA15 | PB09 | PA14 | PA04 | WestSideElectronics / M0 Plus Board / v1.2 2 AUG 2017 | PA13 | PA05 | PA12 | PA06 | PA11 | PA07 | PA10 | PA9 | PB10 | PB11 | PA8